# EAGLE design LIH (EAGLE 7.2.0)
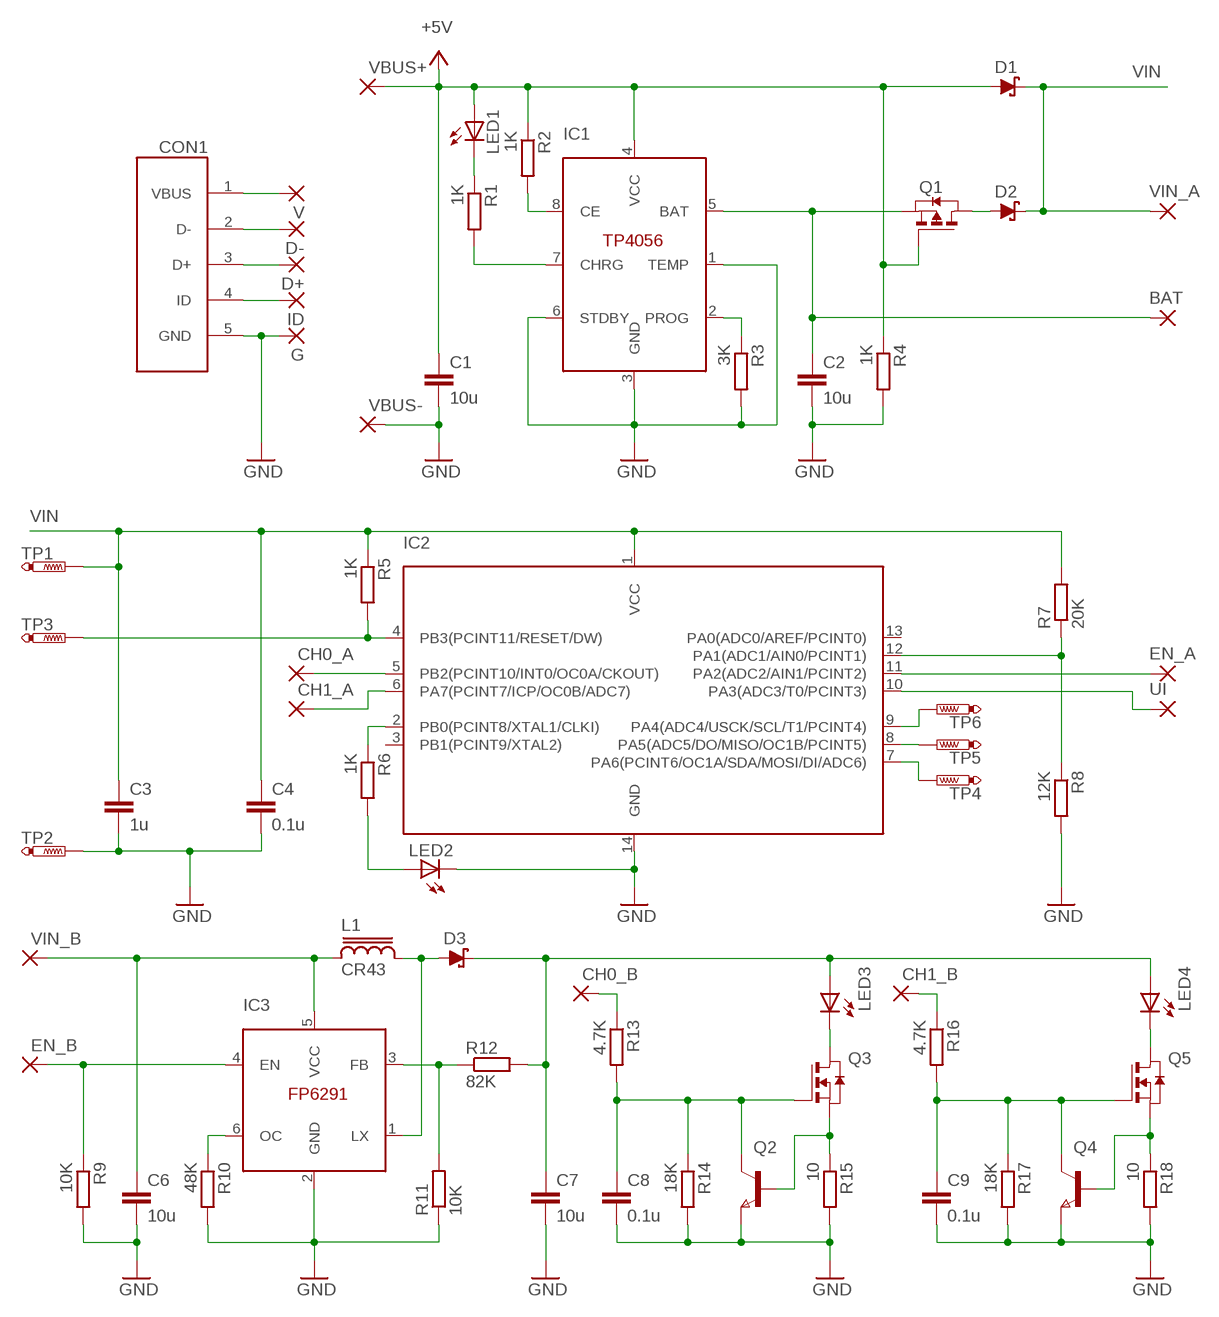
[diagram p0: schematic, sheet 1]

## Parts
BAT  WIREPADSMD1,27-254  1,6/0,8  [1,6/0,8]
C1  10u  C-EUC0805K  [C0805K]
C2  10u  C-EUC0805K  [C0805K]
C3  1u  C-EUC0805K  [C0805K]
C4  0.1u  C-EUC0805K  [C0805K]
C6  10u  C-EUC0805K  [C0805K]
C7  10u  C-EUC0805K  [C0805K]
C8  0.1u  C-EUC0805K  [C0805K]
C9  0.1u  C-EUC0805K  [C0805K]
CH0_A  1,6/0,8  [1,6/0,8]
CH0_B  1,6/0,8  [1,6/0,8]
CH1_A  1,6/0,8  [1,6/0,8]
CH1_B  1,6/0,8  [1,6/0,8]
CON1  MK5P  [MK5P]
D1  SCHOTTKYSCHOTTKY-DO214AC  [DO214AC]
D2  SCHOTTKYSCHOTTKY-DO214AC  [DO214AC]
D3  SCHOTTKYSCHOTTKY-DO214AC  [DO214AC]
D+  SMD2  [SMD1,27-2,54]
D-  SMD2  [SMD1,27-2,54]
EN_A  WIREPADSMD1,27-254  1,6/0,8  [1,6/0,8]
EN_B  WIREPADSMD1,27-254  1,6/0,8  [1,6/0,8]
G  SMD2  [SMD1,27-2,54]
IC1  TP4056  [SO8]
IC2  ATTINY24A  [SO14]
IC3  FP6291  [SOT-23-6]
ID  SMD2  [SMD1,27-2,54]
L1  CR43  [CR43]
LED1  LEDSML0805  [SML0805]
LED2  LEDSML0805  [SML0805]
LED3  2835  [2835]
LED4  2835  [2835]
Q1  PMOSSOT23  [SOT-23]
Q2  NPNSOT23  [SOT-23]
Q3  NMOSSOT23  [SOT-23]
Q4  NPNSOT23  [SOT-23]
Q5  NMOSSOT23  [SOT-23]
R1  1K  R-EU_R0805  [R0805]
R2  1K  R-EU_R0805  [R0805]
R3  3K  R-EU_R0805  [R0805]
R4  1K  R-EU_R0805  [R0805]
R5  1K  R-EU_R0805  [R0805]
R6  1K  R-EU_R0805  [R0805]
R7  20K  R-EU_R0805  [R0805]
R8  12K  R-EU_R0805  [R0805]
R9  10K  R-EU_R0805  [R0805]
R10  48K  R-EU_R0805  [R0805]
R11  10K  R-EU_R0805  [R0805]
R12  82K  R-EU_R0805  [R0805]
R13  4.7K  R-EU_R0805  [R0805]
R14  18K  R-EU_R0805  [R0805]
R15  10  R-EU_R0805  [R0805]
R16  4.7K  R-EU_R0805  [R0805]
R17  18K  R-EU_R0805  [R0805]
R18  10  R-EU_R0805  [R0805]
TP1  PTR1TP10R  [TP10R]
TP2  PTR1TP10R  [TP10R]
TP3  PTR1TP10R  [TP10R]
TP4  PTR1TP10R  [TP10R]
TP5  PTR1TP10R  [TP10R]
TP6  PTR1TP10R  [TP10R]
UI  WIREPADSMD1,27-254  1,6/0,8  [1,6/0,8]
V  SMD2  [SMD1,27-2,54]
VBUS+  WIREPADSMD1,27-254  1,6/0,8  [1,6/0,8]
VBUS-  WIREPADSMD1,27-254  1,6/0,8  [1,6/0,8]
VIN_A  WIREPADSMD1,27-254  1,6/0,8  [1,6/0,8]
VIN_B  WIREPADSMD1,27-254  1,6/0,8  [1,6/0,8]

## Nets
5V6: C7.1 D3.C LED3.1(A) LED4.1(A) R12.2
+5V: C1.1 D1.A IC1.4(VCC) LED1.A Q1.3(G) R2.1 R4.1 VBUS+.1(P)
BAT: BAT.1(P) C2.1 IC1.5(BAT) Q1.2(S)
GND: C1.2 C2.2 C3.2 C4.2 C6.2 C7.2 C8.2 C9.2 CON1.5(GND) G.1(P) IC1.1(TEMP) IC1.3(GND) IC1.6(STDBY) IC2.14(GND) IC3.2(GND) LED2.C Q2.2(E) Q4.2(E) R3.2 R4.2 R8.2 R9.2 R10.2 R11.1 R14.2 R15.2 R17.2 R18.2 TP2.TP VBUS-.1(P)
N$1: CON1.1(VBUS) V.1(P)
N$2: LED2.A R6.2
N$3: D2.A Q1.1(D)
N$4: IC2.7(PA6(PCINT6/OC1A/SDA/MOSI/DI/ADC6)) TP4.TP
N$5: IC1.7(CHRG) R1.2
N$6: IC1.8(CE) R2.2
N$7: Q4.3(B) Q5.2(S) R18.1
N$8: LED1.C R1.1
N$9: IC1.2(PROG) R3.1
N$10: IC3.6(OC) R10.1
N$11: IC2.8(PA5(ADC5/DO/MISO/OC1B/PCINT5)) TP5.TP
N$12: D3.A IC3.1(LX) L1.2
N$13: LED3.2(C) Q3.1(D)
N$14: LED4.2(C) Q5.1(D)
N$15: IC3.3(FB) R11.2 R12.1
N$17: C8.1 Q2.1(C) Q3.3(G) R13.2 R14.1
N$18: Q2.3(B) Q3.2(S) R15.1
N$19: C9.1 Q4.1(C) Q5.3(G) R16.2 R17.1
N$21: CON1.2(D-) D-.1(P)
N$22: CON1.3(D+) D+.1(P)
N$23: CON1.4(ID) ID.1(P)
N$24: IC2.9(PA4(ADC4/USCK/SCL/T1/PCINT4)) TP6.TP
N$25: IC2.4(PB3(PCINT11/RESET/DW)) R5.2 TP3.TP
N$26: CH0_A.1(P) IC2.5(PB2(PCINT10/INT0/OC0A/CKOUT))
N$27: CH1_A.1(P) IC2.6(PA7(PCINT7/ICP/OC0B/ADC7))
N$29: CH0_B.1(P) R13.1
N$31: EN_A.1(P) IC2.11(PA2(ADC2/AIN1/PCINT2))
N$32: IC2.12(PA1(ADC1/AIN0/PCINT1)) R7.1 R8.1
N$33: CH1_B.1(P) R16.1
N$35: IC2.10(PA3(ADC3/T0/PCINT3)) UI.1(P)
N$36: EN_B.1(P) IC3.4(EN) R9.1
N$37: IC2.2(PB0(PCINT8/XTAL1/CLKI)) R6.1
N$38: C6.1 IC3.5(VCC) L1.1 VIN_B.1(P)
VIN: C3.1 C4.1 D1.C D2.C IC2.1(VCC) R5.1 R7.2 TP1.TP VIN_A.1(P)
Unconnected: IC2.3(PB1(PCINT9/XTAL2)) IC2.13(PA0(ADC0/AREF/PCINT0))

## Library data of the parts
BAT CH0_A CH0_B CH1_A CH1_B EN_A EN_B UI VBUS+ VBUS- VIN_A VIN_B = wirepad:1,6/0,8: THROUGH-HOLE PAD
C1-C4 C6-C9 = resistor:C-EU: CAPACITOR, European symbol
CON1 = Connector:MK5P
D1-D3 = diode:SCHOTTKY
D+ D- G ID V = wirepad:SMD2: SMD PAD
IC1 = IC:TP4056
IC2 = IC:ATTINY24A: ATTINY24A
IC3 = IC:FP6291
L1 = Inductor:CR43
LED1 LED2 = led:LED: LED OSRAM: - CHIPLED LG R971, LG N971, LY N971, LG Q971, LY Q971, LO R971, LY R971 LH N974, LH R974 LS Q976, LO Q976, LY Q976 LO Q996 - Hyper CHIPLED LW Q18S LB Q993, LB Q99A, LB R99A - SideLED LS A670, LO A670, LY A670, LG A670, LP A670 LB A673, LV A673, LT A673, LW A673 LH A674 LY A675 LS A676, LA A676, LO A676, LY A676, LW A676 LS A679, LY A679, LG A679 - Hyper Micro SIDELED® LS Y876, LA Y876, LO Y876, LY Y876 LT Y87S - SmartLED LW L88C, LW L88S LB L89C, LB L89S, LG L890 LS L89K, LO L89K, LY L89K LS L896, LA L896, LO L896, LY L896 - TOPLED LS T670, LO T670, LY T670, LG T670, LP T670 LSG T670, LSP T670, LSY T670, LOP T670, LYG T670 LG T671, LOG T671, LSG T671 LB T673, LV T673, LT T673, LW T673 LH T674 LS T676, LA T676, LO T676, LY T676, LB T676, LH T676, LSB T676, LW T676 LB T67C, LV T67C, LT T67C, LS T67K, LO T67K, LY T67K, LW E67C LS E67B, LA E67B, LO E67B, LY E67B, LB E67C, LV E67C, LT E67C LW T67C LS T679, LY T679, LG T679 LS T770, LO T770, LY T770, LG T770, LP T770 LB T773, LV T773, LT T773, LW T773 LH T774 LS E675, LA E675, LY E675, LS T675 LS T776, LA T776, LO T776, LY T776, LB T776 LHGB T686 LT T68C, LB T68C - Hyper Mini TOPLED® LB M676 - Mini TOPLED Santana® LG M470 LS M47K, LO M47K, LY M47K Source: http://www.osram.convergy.de LUXEON: - LUMILED® LXK2-PW12-R00, LXK2-PW12-S00, LXK2-PW14-U00, LXK2-PW14-V00 LXK2-PM12-R00, LXK2-PM12-S00, LXK2-PM14-U00 LXK2-PE12-Q00, LXK2-PE12-R00, LXK2-PE12-S00, LXK2-PE14-T00, LXK2-PE14-U00 LXK2-PB12-K00, LXK2-PB12-L00, LXK2-PB12-M00, LXK2-PB14-N00, LXK2-PB14-P00, LXK2-PB14-Q00 LXK2-PR12-L00, LXK2-PR12-M00, LXK2-PR14-Q00, LXK2-PR14-R00 LXK2-PD12-Q00, LXK2-PD12-R00, LXK2-PD12-S00 LXK2-PH12-R00, LXK2-PH12-S00 LXK2-PL12-P00, LXK2-PL12-Q00, LXK2-PL12-R00 Source: www.luxeon.com KINGBRIGHT: KA-3528ASYC Source: www.kingbright.com
LED3 LED4 = led:2835
Q1 = zetex:PMOSSOT23: MOS FET; OC_FARNELL: unknown; OC_NEWARK: unknown
Q2 Q4 = zetex:NPNSOT23: NPN TRANSISTOR; MPN: DSS20201L-7; OC_FARNELL: 1710688; OC_NEWARK: 25R4555
Q3 Q5 = zetex:NMOSSOT23: MOS FET; OC_FARNELL: unknown; OC_NEWARK: unknown
R1-R18 = resistor:R-EU_: RESISTOR, European symbol
TP1-TP6 = testpad:PTR1: TEST PIN

## Board
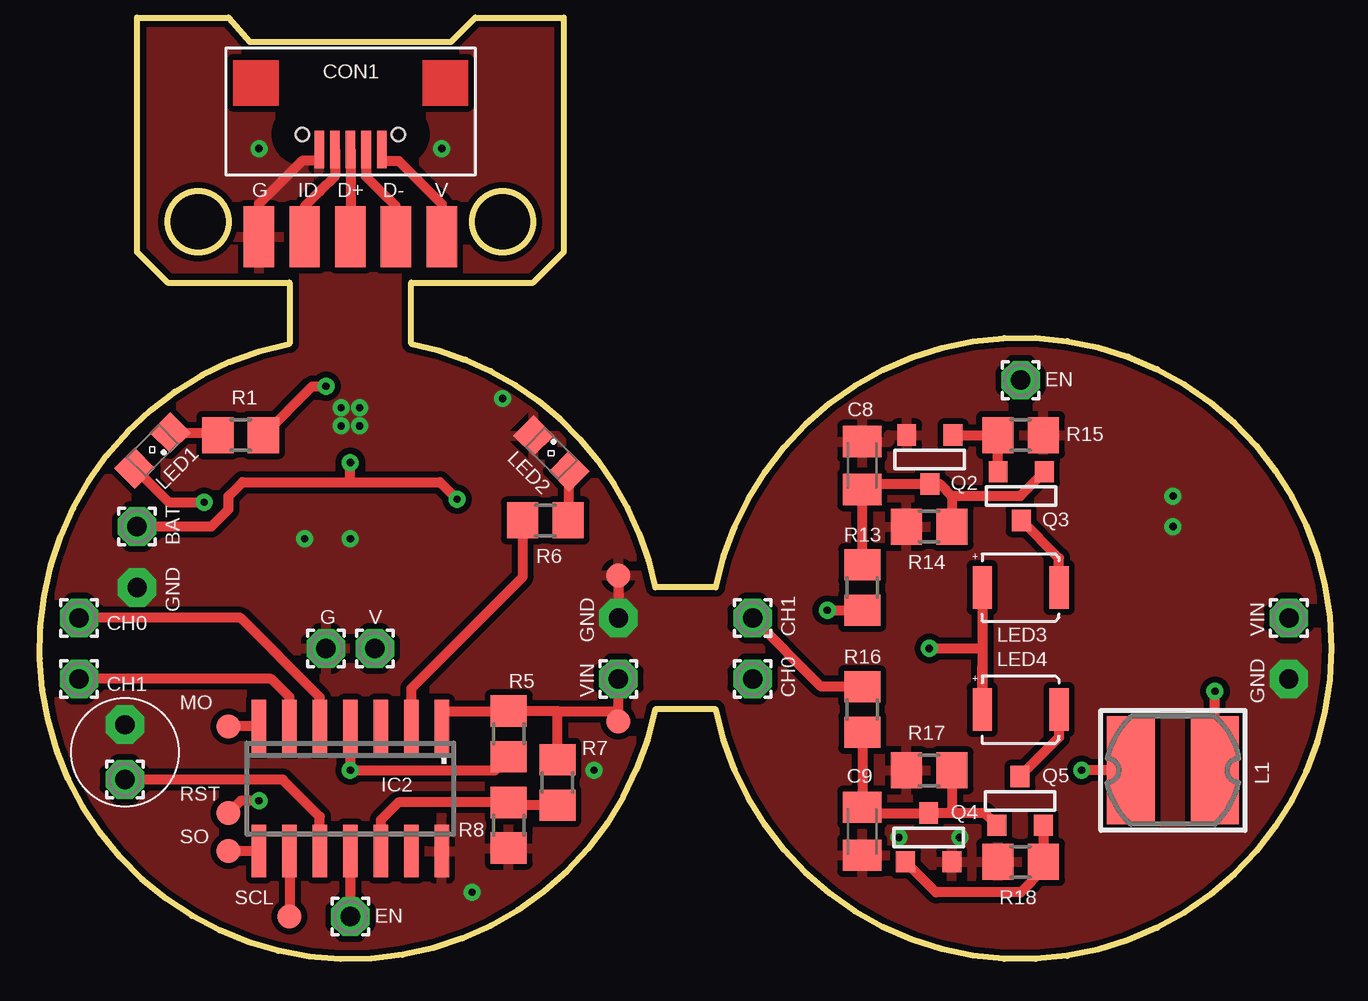
[diagram p1: board, top side]
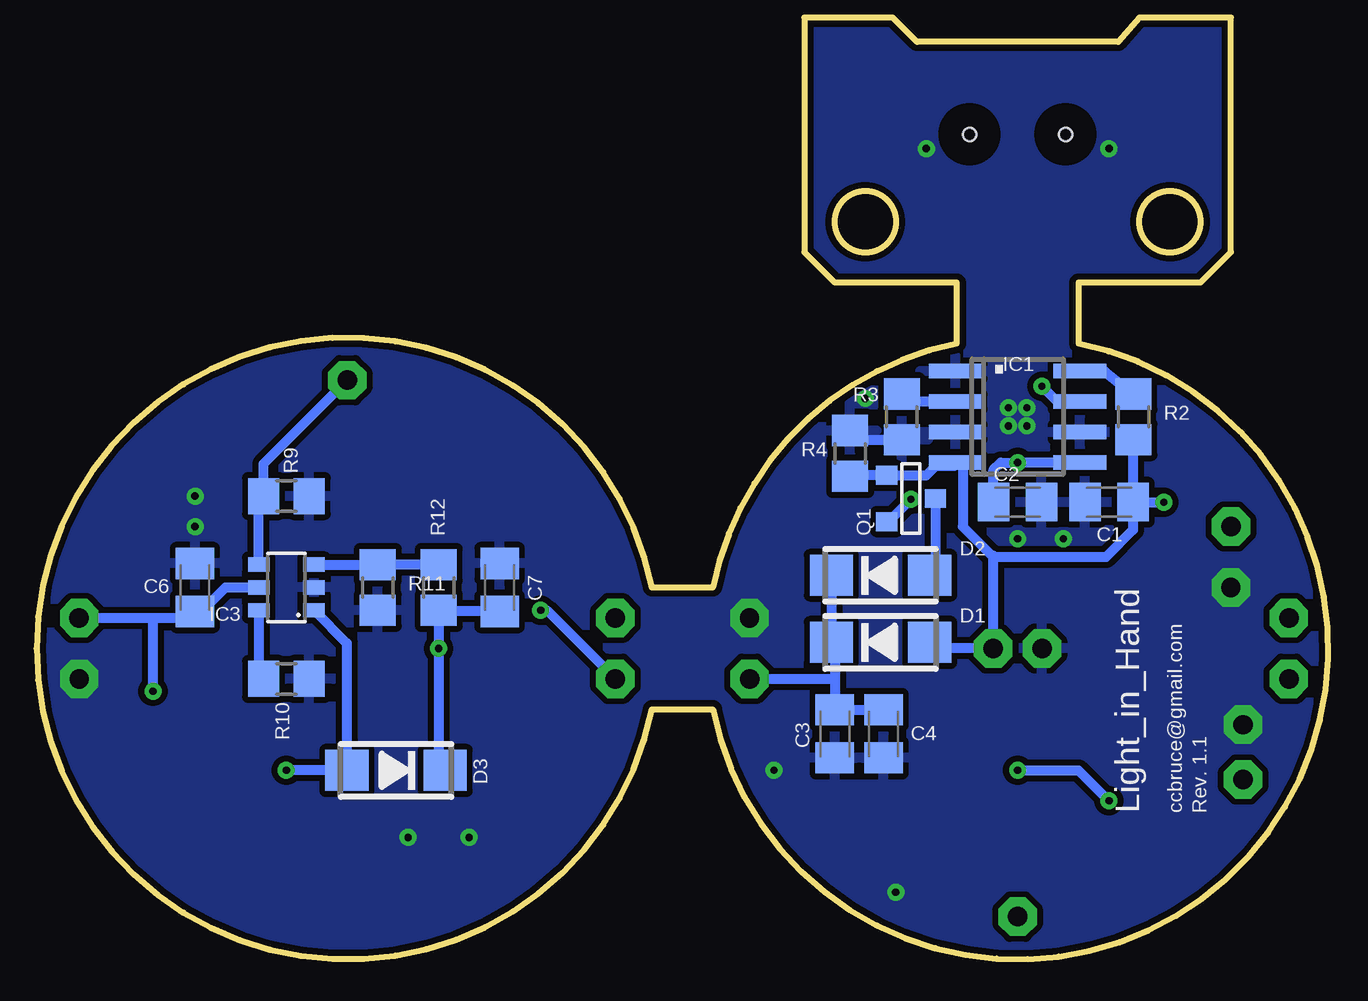
[diagram p2: board, bottom side, seen from below]

No outline drawn. Coordinates in mm, seen from the top.
Copper layers (1*16): Top 0.035mm / dielectric 1.5mm / Bottom 0.035mm
Design rules "default *": minimum track width 10mil, minimum drill 24mil, track to track 8mil, track to pad 8mil, pad to pad 8mil, via to via 8mil, smd to smd 8mil, copper to edge 40mil, drill to drill 8mil, minimum pad ring 10mil, minimum via ring 8mil, stop-mask expansion 4mil, vias tented up to drill 0.6mm, thermal gap 10mil
tRestrict: area -7.6,16.5 to -5.1,19.1; area 5.1,16.5 to 7.6,19.1; 18 lines
bRestrict: area -7.6,16.5 to -5.1,19.1; area 5.1,16.5 to 7.6,19.1; 18 lines
Milling: area -7.6,16.5 to -5.1,19.1; area 5.1,16.5 to 7.6,19.1; 18 lines

### Footprints (pad centres in the part's own frame; a part is rotated, then mirrored left to right if it is on the bottom)
1,6/0,8 = drill 0.813 pad 1.6 octagon: 1 0,0
C0805K = smd 1.3 x 1.6: 1 -1,0; 2 1,0
MK5P = smd 1.55 x 0.4: 1 1.685,1.18; 2 1.685,0.53; 3 1.685,-0.12; 4 1.685,-0.77; 5 1.685,-1.42 | hole 0.55: 1.06,1.88; 1.06,-2.12
DO214AC = smd 1.8 x 1.7: A 2.05,0; C -2.05,0
SMD1,27-2,54 = smd 1.27 x 2.54: 1 0,0
SO8 = smd 0.6 x 2.2: 1 -1.905,-2.6; 2 -0.635,-2.6; 3 0.635,-2.6; 4 1.905,-2.6; 5 1.905,2.6; 6 0.635,2.6; 7 -0.635,2.6; 8 -1.905,2.6
SO14 = smd 0.6 x 2.2: 1 -3.81,-2.6; 2 -2.54,-2.6; 3 -1.27,-2.6; 4 0,-2.6; 5 1.27,-2.6; 6 2.54,-2.6; 7 3.81,-2.6; 8 3.81,2.6; 9 2.54,2.6; 10 1.27,2.6; 11 0,2.6; 12 -1.27,2.6; 13 -2.54,2.6; 14 -3.81,2.6
SOT-23-6 = smd 0.6 x 0.9: 1 -0.95,-1.15; 2 0,-1.15; 3 0.95,-1.15; 4 0.95,1.15; 5 0,1.15; 6 -0.95,1.15
CR43 = smd 4.5 x 2: 1 0,1.75; 2 0,-1.75
SML0805 = smd 1.2 x 1.2: A 1.05,0; C -1.05,0
2835 = smd 0.8 x 1.78: 1 -1.6,0; 2 1.6,0
SOT-23 = smd 0.787 x 0.889: 1 0.025,-1.016; 2 -0.94,1.016; 3 0.991,1.016
R0805 = smd 1.3 x 1.5: 1 -0.95,0; 2 0.95,0
TP10R = smd 1 x 1: TP 0,0

### Placement (x,y rotation side)
BAT  -8.89,5.08 0 top
C1  -3.81,6.1 180 bottom
C2  0,6.1 0 bottom
C3  7.62,-3.56 270 bottom
C4  5.59,-3.56 270 bottom
C6  34.29,2.54 90 bottom
C7  21.59,2.54 90 bottom
C8  21.34,7.62 90 top
C9  21.34,-7.62 270 top
CH0_A  -11.3,1.27 0 top
CH0_B  16.76,-1.27 0 top
CH1_A  -11.3,-1.27 0 top
CH1_B  16.76,1.27 0 top
CON1  0.13,22.48 270 top
D1  5.71,0.25 0 bottom
D2  5.71,3.05 0 bottom
D3  25.91,-5.08 180 bottom
D+  0.01,17.14 0 top
D-  1.91,17.14 0 top
EN_A  0,-11.18 0 top
EN_B  27.94,11.18 0 top
G  -3.81,17.14 0 top
IC1  0,9.65 270 bottom
IC2  0,-5.84 180 top
IC3  30.48,2.54 90 bottom
ID  -1.91,17.14 0 top
L1  34.29,-5.08 270 top
LED1  -8.26,8.26 225 top
LED2  8.38,8.13 315 top
LED3  27.94,2.54 0 top
LED4  27.94,-2.54 0 top
Q1  4.45,6.22 90 bottom
Q2  24.13,7.87 0 top
Q3  27.94,6.35 0 top
Q4  24.13,-7.87 180 top
Q5  27.94,-6.35 180 top
R1  -4.57,8.89 0 top
R2  -4.83,9.65 90 bottom
R3  4.83,9.65 270 bottom
R4  6.99,8.13 90 bottom
R5  6.6,-3.56 270 top
R6  8.13,5.33 0 top
R7  8.64,-5.59 90 top
R8  6.6,-7.37 270 top
R9  30.48,6.35 0 bottom
R10  30.48,-1.27 0 bottom
R11  26.67,2.54 90 bottom
R12  24.13,2.54 270 bottom
R13  21.34,2.54 90 top
R14  24.13,5.08 180 top
R15  27.94,8.89 0 top
R16  21.34,-2.54 270 top
R17  24.13,-5.08 180 top
R18  27.94,-8.89 180 top
TP1  11.18,-3.05 0 top
TP2  11.18,3.05 0 top
TP3  -5.08,-6.86 0 top
TP4  -5.08,-3.24 0 top
TP5  -5.08,-8.44 0 top
TP6  -2.54,-11.18 0 top
UI  -9.4,-5.46 0 top
V  3.81,17.14 0 top
VBUS+  1.02,0 0 top
VBUS-  -1.02,0 0 top
VIN_A  11.18,-1.27 0 top
VIN_B  39.12,1.27 0 top

### Tracks (layer width: path | path; a pad name or v marks a point on that pad's centre or on a via)
5V6  (via drill 0.3)
  Top 0.406: LED3.1 26.34,0 | 26.34,0 LED4.1 26.34,-0.76 | v24.13,0 26.34,0
  Bottom 0.406: C7.1 24.13,1.54 | 24.13,1.54 R12.2 | 24.13,1.54 v24.13,0 24.13,-5.08 D3.C
+5V  (via drill 0.3)
  Top 0.406: LED1.A -7.58,6.1 v-6.1,6.1
  Bottom 0.406: -4.83,6.1 C1.1 -4.81,4.94 -3.68,3.81 1.02,3.81 | -4.83,6.1 R2.1 | R4.1 6.99,7.21 Q1.3 3.81,7.21 3.4,7.62 2.6,7.62 IC1.4 2.29,7.75 2.29,5.08 1.02,3.81 | 1.02,3.81 VBUS+.1 3.67,0 D1.A | 1.02,3.81 1.02,3.87 | -4.83,6.1 v-6.1,6.1
BAT  (via drill 0.3)
  Top 0.406: 0,6.93 3.73,6.93 v4.45,6.22 | 0,6.93 -4.5,6.93 -5.08,6.35 -5.08,5.8 -5.8,5.08 BAT.1 | 0,6.93 v0,7.75
  Bottom 0.406: IC1.5 v0,7.75 0.7,7.75 1,7.45 C2.1 | v4.45,6.22 5.38,5.28 Q1.2
GND  (via drill 0.3, 0.8 pad 1.6)
  Top 0.406: CON1.5 -1.29,20.32 -2.01,20.32 -3.81,18.52 G.1 | TP2.TP v11.18,1.27
  Bottom 0.406: 4.83,8.64 R3.2 6.99,8.7 R4.2
  other vias: -9.4,-3.17 -8.89,2.54 0,4.57 6.35,10.41 39.12,-1.27 -3.81,20.83 3.81,20.83 -1.91,4.57 -0.38,10.03 0.38,10.03 -0.38,9.27 0.38,9.27 34.29,5.08 5.08,-10.16 10.16,-5.08 34.29,6.35 22.86,-7.87 25.4,-7.87
  pour Bottom (isolate 0.254): -13.97,27.94 41.91,27.94 41.91,-13.97 -13.97,-13.97
  pour Top (isolate 0.254): -13.97,27.94 41.91,27.94 41.91,-13.97 -13.97,-13.97
N$1
  Top 0.406: CON1.1 1.31,20.32 2.01,20.32 3.81,18.52 V.1
N$2
  Top 0.406: R6.2 9.12,5.33 LED2.A
N$3
  Bottom 0.406: Q1.1 3.43,3.05 D2.A
N$4
  Top 0.406: IC2.7 TP4.TP
N$5  (via drill 0.3)
  Top 0.406: R1.2 -1.59,10.92 v-1.02,10.92
  Bottom 0.406: IC1.7 -1.65,10.29 v-1.02,10.92
N$6
  Bottom 0.406: IC1.8 -3.62,11.56 R2.2
N$7
  Top 0.406: Q5.2 R18.1 28.89,-9.21 27.94,-10.16 24.41,-10.16 Q4.3
N$8
  Top 0.406: LED1.C -5.52,9 R1.1
N$9
  Bottom 0.406: IC1.2 4.83,10.29 R3.1
N$10
  Bottom 0.406: IC3.6 31.63,-1.27 R10.1
N$11
  Top 0.406: IC2.8 TP5.TP
N$12  (via drill 0.3)
  Top 0.406: L1.2 v30.48,-5.08
  Bottom 0.406: v30.48,-5.08 D3.A 27.96,0.22 IC3.1
N$13
  Top 0.406: LED3.2 29.54,3.76 Q3.1
N$14
  Top 0.406: LED4.2 29.54,-3.71 Q5.1
N$15
  Bottom 0.406: IC3.3 R11.2 R12.1
N$17
  Top 0.406: R13.2 C8.1 21.34,6.86 Q2.1 24.57,6.86 25.08,6.35 | 25.08,6.35 R14.1 | Q3.3 27.94,6.38 27.94,6.35 25.08,6.35
N$18
  Top 0.406: Q3.2 R15.1 Q2.3
N$19
  Top 0.406: R16.2 C9.1 21.34,-6.86 Q4.1 25.08,-6.86 | Q5.3 26.44,-6.86 25.08,-6.86 | R17.1 25.08,-6.86
N$21
  Top 0.406: CON1.2 0.66,19.66 1.27,19.05 1.91,18.41 D-.1
N$22
  Top 0.406: CON1.3 D+.1
N$23
  Top 0.406: CON1.4 -0.64,19.68 -1.27,19.05 -1.91,18.41 ID.1
N$24
  Top 0.406: IC2.9 TP6.TP
N$25  (via drill 0.3)
  Top 0.406: R5.2 6.03,-5.08 v0,-5.08 IC2.4 | v-3.81,-6.35 -4.57,-6.35 TP3.TP
  Bottom 0.406: v0,-5.08 -2.54,-5.08 v-3.81,-6.35
N$26
  Top 0.406: IC2.5 -1.27,-2.04 -4.58,1.27 CH0_A.1
N$27
  Top 0.406: IC2.6 -2.54,-2.03 -3.3,-1.27 CH1_A.1
N$29  (via drill 0.3)
  Top 0.406: v19.88,1.59 R13.1
  Bottom 0.406: v19.88,1.59 19.62,1.59 CH0_B.1
N$31
  Top 0.406: IC2.11 EN_A.1
N$32
  Top 0.406: R7.1 6.6,-6.54 R8.1 2.01,-6.42 1.27,-7.16 IC2.12
N$33
  Top 0.406: R16.1 19.62,-1.59 CH1_B.1
N$35
  Top 0.406: IC2.10 -1.27,-7.01 -2.82,-5.46 UI.1
N$36
  Bottom 0.406: IC3.4 31.63,6.35 R9.1 31.43,7.69 EN_B.1
N$37
  Top 0.406: R6.1 7.18,2.96 2.54,-1.68 IC2.2
N$38  (via drill 0.3)
  Top 0.406: L1.1 v36.04,-1.78
  Bottom 0.406: VIN_B.1 36.04,1.27 | IC3.5 33.02,2.54 34.02,1.54 C6.1 34.29,1.27 35.56,1.27 36.04,1.27 | v36.04,-1.78 36.04,1.27
VIN
  Top 0.406: IC2.1 3.81,-2.61 R5.1 8.64,-2.61 | R7.2 8.64,-2.61 | TP1.TP VIN_A.1 11.18,-2.61 8.64,-2.61
  Bottom 0.406: D2.C D1.C 7.62,0.25 7.62,-1.27 | 7.62,-1.27 C3.1 C4.1 | VIN_A.1 7.62,-1.27

### Text on the board
tPlace: EN | GND | CH0 | G | V | CH1 | VIN | GND | CH1 | VIN | CH0 | GND | MO | . | RST | SO | SCL | EN
bPlace: .
bNames: Rev. 1.1 | ccbruce@gmail.com | Light_in_Hand